# EAGLE design GaN_Schaltnetzteil (EAGLE 9.0.1)
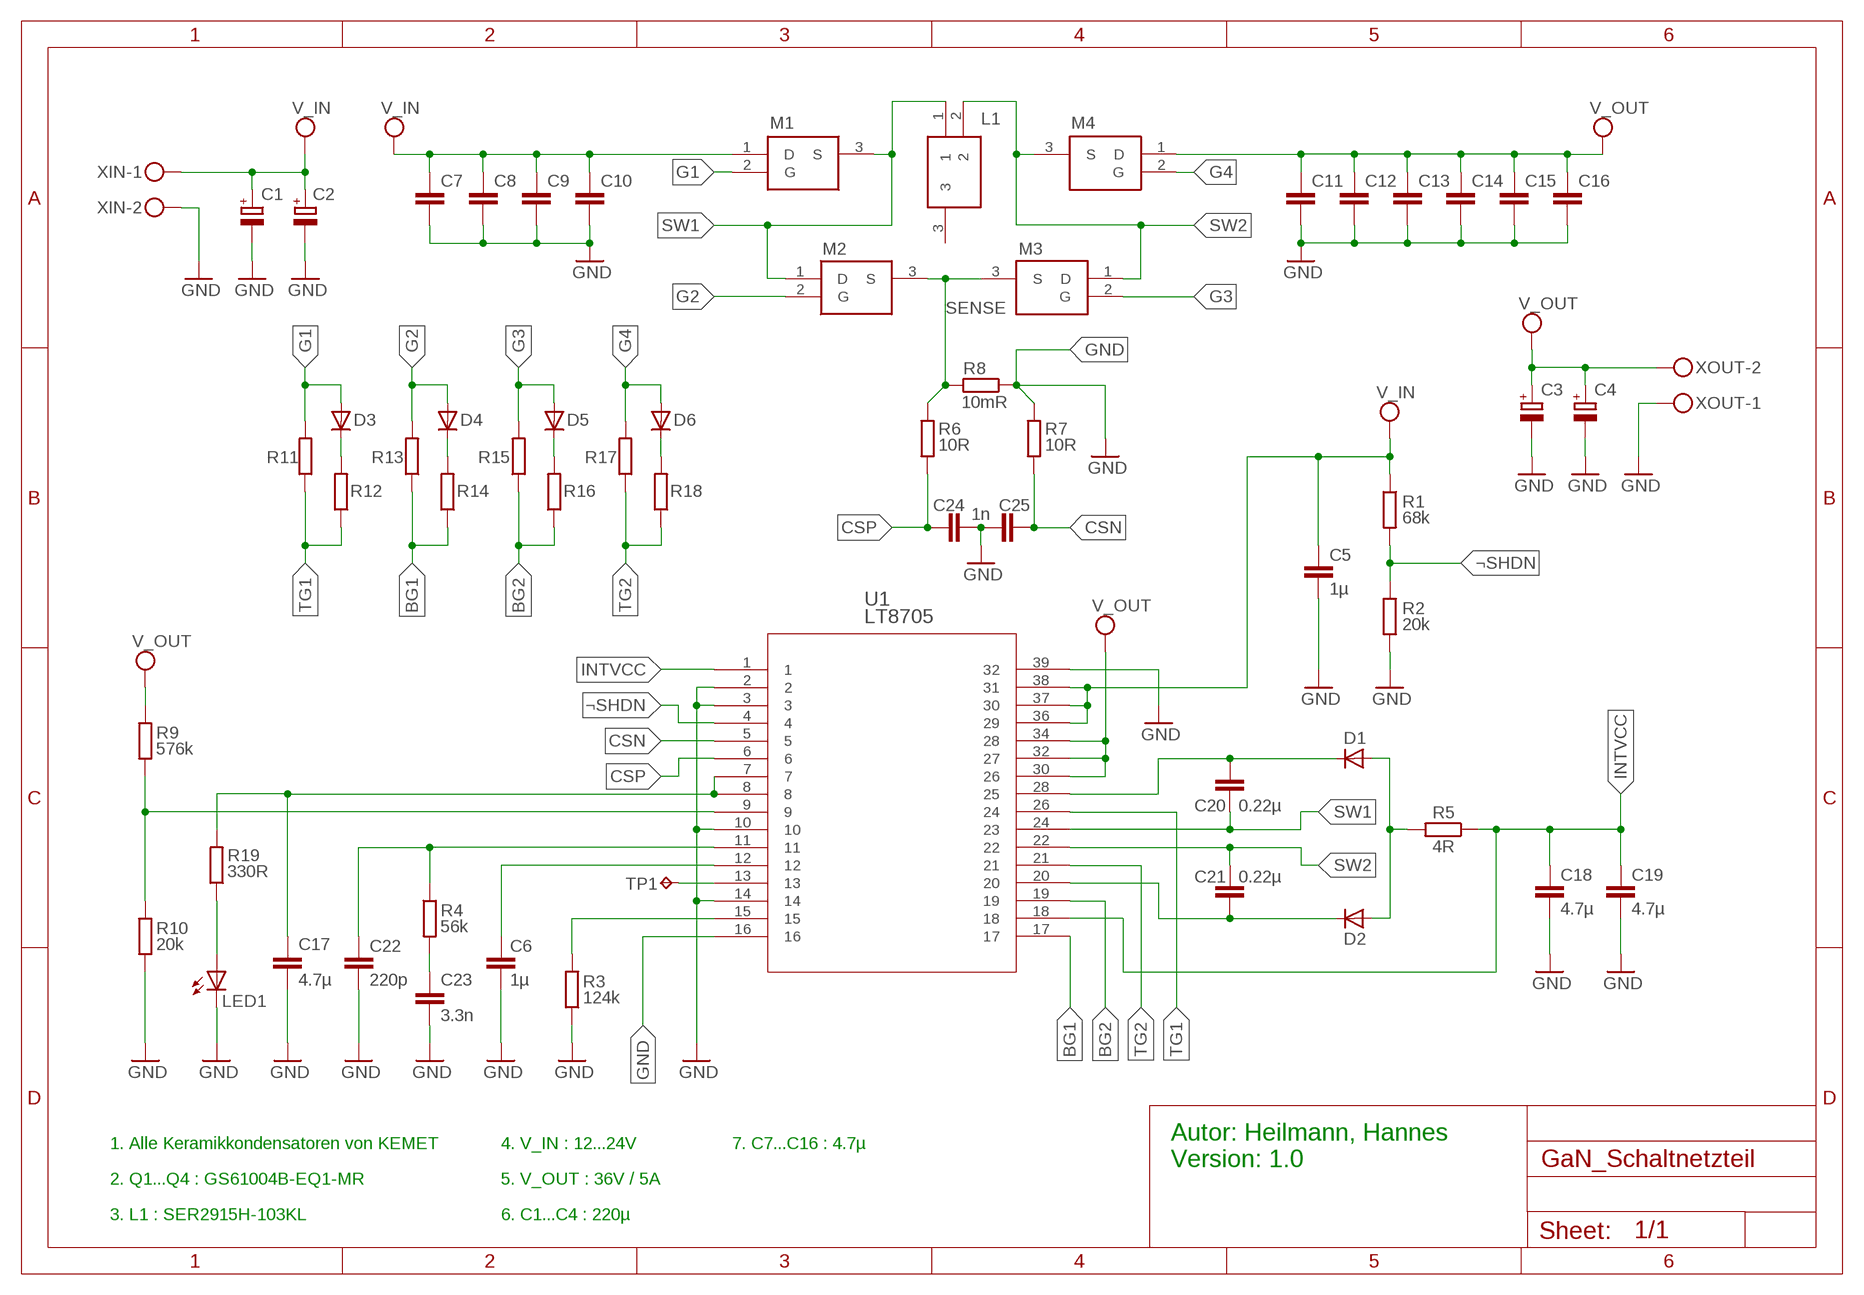
[diagram p0: schematic, sheet 1]

## Parts
C1  220µ  CPOL-EUG  [PANASONIC_G]
C2  220µ  CPOL-EUG  [PANASONIC_G]
C3  220µ  CPOL-EUG  [PANASONIC_G]
C4  220µ  CPOL-EUG  [PANASONIC_G]
C5  1µ  C-EUC1206K  [C1206K]
C6  1µ  C-EUC1206K  [C1206K]
C7  4.7µ  C-EUC1206K  [C1206K]
C8  4.7µ  C-EUC1206K  [C1206K]
C9  4.7µ  C-EUC1206K  [C1206K]
C10  4.7µ  C-EUC1206K  [C1206K]
C11  4.7µ  C-EUC1206K  [C1206K]
C12  4.7µ  C-EUC1206K  [C1206K]
C13  4.7µ  C-EUC1206K  [C1206K]
C14  4.7µ  C-EUC1206K  [C1206K]
C15  4.7µ  C-EUC1206K  [C1206K]
C16  4.7µ  C-EUC1206K  [C1206K]
C17  4.7µ  C-EUC1206K  [C1206K]
C18  4.7µ  C-EUC1206K  [C1206K]
C19  4.7µ  C-EUC1206K  [C1206K]
C20  0.22µ  C-EUC1206K  [C1206K]
C21  0.22µ  C-EUC1206K  [C1206K]
C22  220p  C-EUC1206K  [C1206K]
C23  3.3n  C-EUC1206K  [C1206K]
C24  1n  C-EUC1206K  [C1206K]
C25  1n  C-EUC1206K  [C1206K]
D1  GF1  [SMA-DO214AC]
D2  GF1  [SMA-DO214AC]
D3  GF1  [SMA-DO214AC]
D4  GF1  [SMA-DO214AC]
D5  GF1  [SMA-DO214AC]
D6  GF1  [SMA-DO214AC]
L1  SER2915H-103KL  [SER2900]
LED1  LEDSMT1206  [1206]
M1  GS61004B-E01-MR  [GS61004B-E01-MR]
M2  GS61004B-E01-MR  [GS61004B-E01-MR]
M3  GS61004B-E01-MR  [GS61004B-E01-MR]
M4  GS61004B-E01-MR  [GS61004B-E01-MR]
R1  68k  R-EU_R1206  [R1206]
R2  20k  R-EU_R1206  [R1206]
R3  124k  R-EU_R1206  [R1206]
R4  56k  R-EU_R1206  [R1206]
R5  4R  R-EU_R1206  [R1206]
R6  10R  R-EU_R1206  [R1206]
R7  10R  R-EU_R1206  [R1206]
R8  10mR  R-EU_R1206  [R1206]
R9  576k  R-EU_R1206  [R1206]
R10  20k  R-EU_R1206  [R1206]
R11  R-EU_R1206  [R1206]
R12  R-EU_R1206  [R1206]
R13  R-EU_R1206  [R1206]
R14  R-EU_R1206  [R1206]
R15  R-EU_R1206  [R1206]
R16  R-EU_R1206  [R1206]
R17  R-EU_R1206  [R1206]
R18  R-EU_R1206  [R1206]
R19  330R  R-EU_R1206  [R1206]
TP1  TPTP08R  [TP08R]
U1  LT8705  [TSSOP-38_FE/AB]
XIN  INPUT  W237-102  [W237-102]
XOUT  OUTPUT  W237-102  [W237-102]

## Nets
BG1: R13.1 R14.1 U1.17
BG2: R15.1 R16.1 U1.19
BOOST1: C20.1 D1.K(C) U1.28
BOOST2: C21.1 D2.K(C) U1.20
CSN: C25.2 R7.1 U1.5
CSP: C24.1 R6.1 U1.6
G1: D3.A M1.2(G) R11.2
G2: D4.A M2.2(G) R13.2
G3: D5.A M3.2(G) R15.2
G4: D6.A M4.2(G) R17.2
GND: C1.- C2.- C3.- C4.- C5.2 C6.2 C7.2 C8.2 C9.2 C10.2 C11.2 C12.2 C13.2 C14.2 C15.2 C16.2 C17.2 C18.2 C19.2 C22.2 C23.2 C24.2 C25.1 LED1.C R2.2 R3.1 R7.2 R8.1 R10.2 U1.2 U1.3 U1.10 U1.14 U1.16 U1.39 XIN.2 XOUT.1
INTVCC: C18.1 C19.1 R5.1 U1.1 U1.18
N$1: LED1.A R19.1
N$2: D3.K(C) R12.2
N$6: D4.K(C) R14.2
N$8: TP1.TP U1.13
N$10: C6.1 U1.12
N$11: R3.2 U1.15
N$12: C23.1 R4.2
N$13: D5.K(C) R16.2
N$14: C22.1 R4.1 U1.11
N$17: D6.K(C) R18.2
N$21: R9.2 R10.1 U1.9
N$22: D1.A D2.A R5.2
N$23: C17.1 R19.2 U1.7 U1.8
SENSE: M2.3(S) M3.3(S) R6.2 R8.2
SW1: C20.2 L1.1 M1.3(S) M2.1(D) U1.24
SW2: C21.2 L1.2 M3.1(D) M4.3(S) U1.22
TG1: R11.1 R12.1 U1.26
TG2: R17.1 R18.1 U1.21
VCC: C1.+ C2.+ C5.1 C7.1 C8.1 C9.1 C10.1 M1.1(D) R1.1 U1.36 U1.37 U1.38 XIN.1 ; supply symbol labelled V_IN
VDD: C3.+ C4.+ C11.1 C12.1 C13.1 C14.1 C15.1 C16.1 M4.1(D) R9.1 U1.30 U1.32 U1.34 XOUT.2 ; supply symbol labelled V_OUT
¬SHDN: R1.2 R2.1 U1.4
Unconnected: L1.3

## Notes on the sheet
- 1. Alle Keramikkondensatoren von KEMET | 4. V_IN : 12...24V | 7. C7...C16 : 4.7µ
- Autor: Heilmann, Hannes
  Version: 1.0
- 2. Q1...Q4 : GS61004B-EQ1-MR | 5. V_OUT : 36V / 5A
- 3. L1 : SER2915H-103KL | 6. C1...C4 : 220µ

## Library data of the parts
C1-C4 = rcl:CPOL-EU: POLARIZED CAPACITOR, European symbol; SPICEPREFIX: C
C5-C25 = rcl:C-EU: CAPACITOR, European symbol; SPICEPREFIX: C
D1 = diode:GF1: DIODE; SPICEPREFIX: D
D2-D6 = diode:GF1: DIODE
L1 = SER2915H-103KL:SER2915H-103KL: Fixed Inductors SER2915H Hi Current 10 uH 10 % 30 A Source: Datasheet <https://componentsearchengine.com/Datasheets/2/SER2915H-103KL.pdf>; DESCRIPTION: Fixed Inductors SER2915H Hi Current 10 uH 10 % 30 A; FARNELL_PART_NUMBER: 2288897; HEIGHT: mm; MANUFACTURER_NAME: COILCRAFT; MANUFACTURER_PART_NUMBER: SER2915H-103KL
LED1 = led:LED: LED OSRAM: - CHIPLED LG R971, LG N971, LY N971, LG Q971, LY Q971, LO R971, LY R971 LH N974, LH R974 LS Q976, LO Q976, LY Q976 LO Q996 - Hyper CHIPLED LW Q18S LB Q993, LB Q99A, LB R99A - SideLED LS A670, LO A670, LY A670, LG A670, LP A670 LB A673, LV A673, LT A673, LW A673 LH A674 LY A675 LS A676, LA A676, LO A676, LY A676, LW A676 LS A679, LY A679, LG A679 - Hyper Micro SIDELED® LS Y876, LA Y876, LO Y876, LY Y876 LT Y87S - SmartLED LW L88C, LW L88S LB L89C, LB L89S, LG L890 LS L89K, LO L89K, LY L89K LS L896, LA L896, LO L896, LY L896 - TOPLED LS T670, LO T670, LY T670, LG T670, LP T670 LSG T670, LSP T670, LSY T670, LOP T670, LYG T670 LG T671, LOG T671, LSG T671 LB T673, LV T673, LT T673, LW T673 LH T674 LS T676, LA T676, LO T676, LY T676, LB T676, LH T676, LSB T676, LW T676 LB T67C, LV T67C, LT T67C, LS T67K, LO T67K, LY T67K, LW E67C LS E67B, LA E67B, LO E67B, LY E67B, LB E67C, LV E67C, LT E67C LW T67C LS T679, LY T679, LG T679 LS T770, LO T770, LY T770, LG T770, LP T770 LB T773, LV T773, LT T773, LW T773 LH T774 LS E675, LA E675, LY E675, LS T675 LS T776, LA T776, LO T776, LY T776, LB T776 LHGB T686 LT T68C, LB T68C - Hyper Mini TOPLED® LB M676 - Mini TOPLED Santana® LG M470 LS M47K, LO M47K, LY M47K Source: http://www.osram.convergy.de LUXEON: - LUMILED® LXK2-PW12-R00, LXK2-PW12-S00, LXK2-PW14-U00, LXK2-PW14-V00 LXK2-PM12-R00, LXK2-PM12-S00, LXK2-PM14-U00 LXK2-PE12-Q00, LXK2-PE12-R00, LXK2-PE12-S00, LXK2-PE14-T00, LXK2-PE14-U00 LXK2-PB12-K00, LXK2-PB12-L00, LXK2-PB12-M00, LXK2-PB14-N00, LXK2-PB14-P00, LXK2-PB14-Q00 LXK2-PR12-L00, LXK2-PR12-M00, LXK2-PR14-Q00, LXK2-PR14-R00 LXK2-PD12-Q00, LXK2-PD12-R00, LXK2-PD12-S00 LXK2-PH12-R00, LXK2-PH12-S00 LXK2-PL12-P00, LXK2-PL12-Q00, LXK2-PL12-R00 Source: www.luxeon.com KINGBRIGHT: KA-3528ASYC Source: www.kingbright.com
M1-M4 = GS61004B-E01-MR:GS61004B-E01-MR: MOSFET 100V 45A E-Mode GaN Source: Datasheet <https://componentsearchengine.com/Datasheets/1/GS61004B-E01-MR.pdf>; DESCRIPTION: MOSFET 100V 45A E-Mode GaN; HEIGHT: mm; MANUFACTURER_NAME: GaN Systems; MANUFACTURER_PART_NUMBER: GS61004B-E01-MR; MOUSER_PART_NUMBER: 499-GS61004B-E01-MR
R1-R19 = resistor:R-EU_: RESISTOR, European symbol
TP1 = testpad:TP: Test pad
U1 = LT8705:LT8705
XIN XOUT = con-wago-500:W237-102: WAGO SCREW CLAMP; MPN: 237-102; OC_FARNELL: unknown; OC_NEWARK: 70K9898

## Board
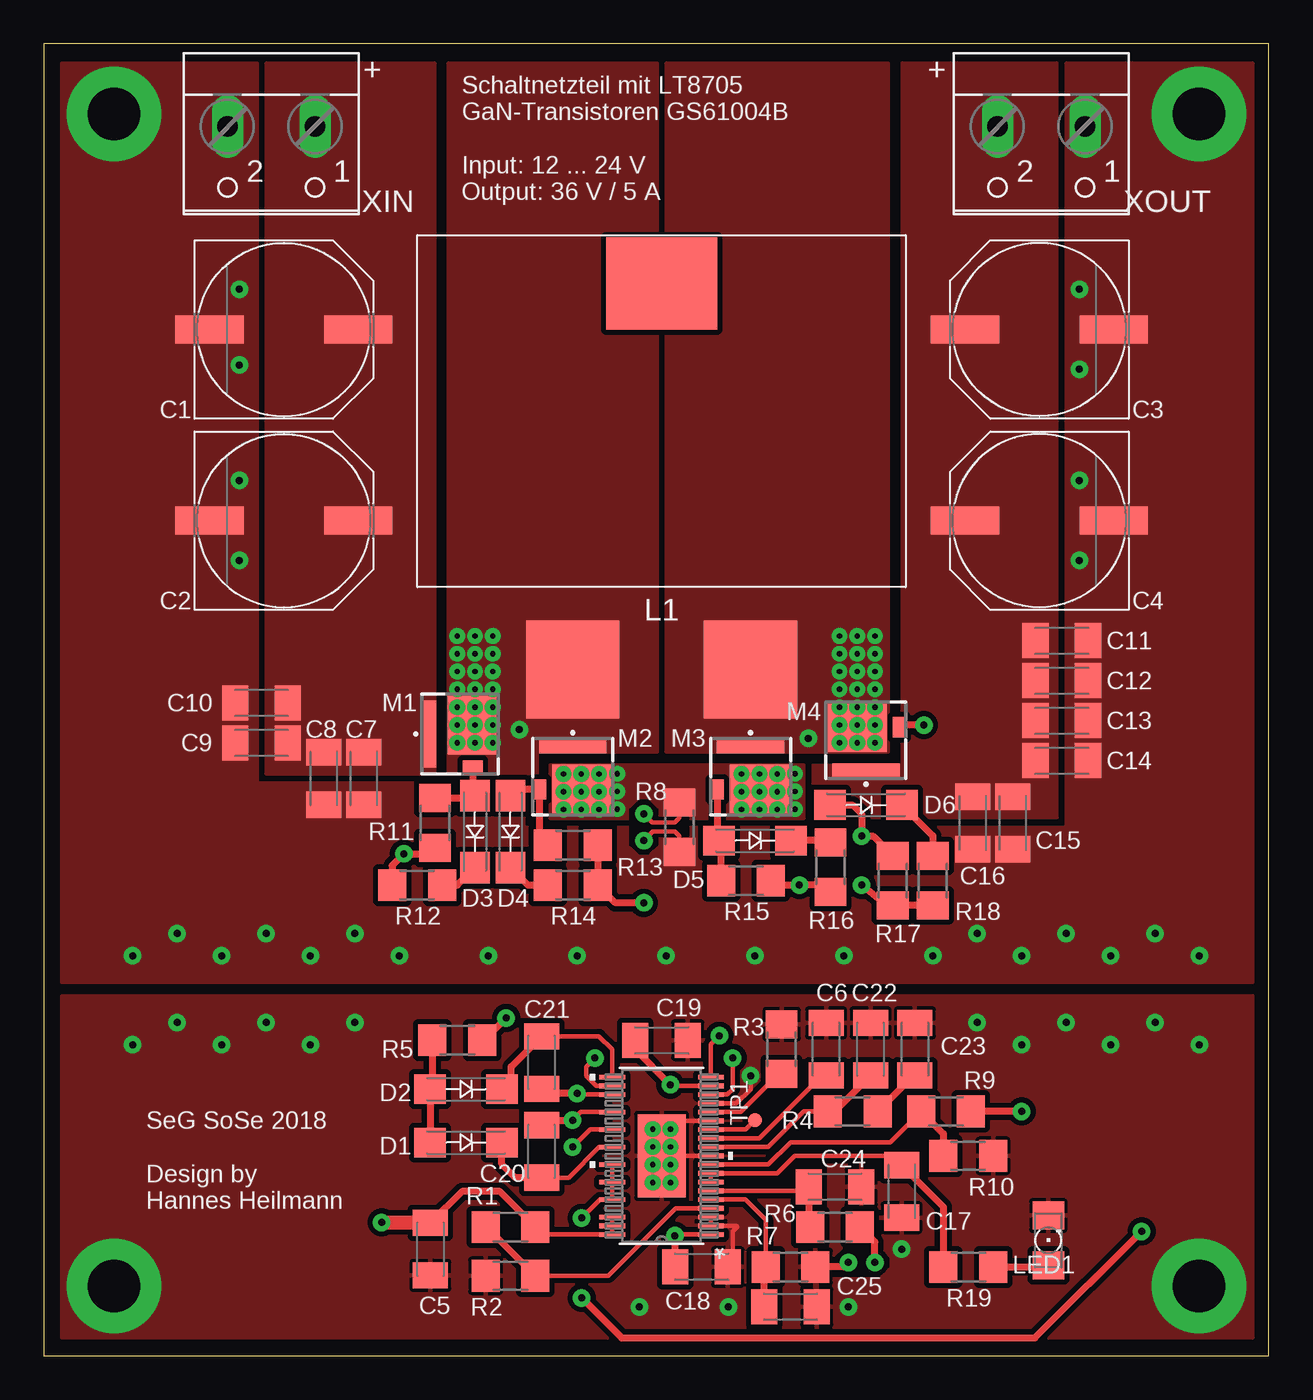
[diagram p1: board, top side]
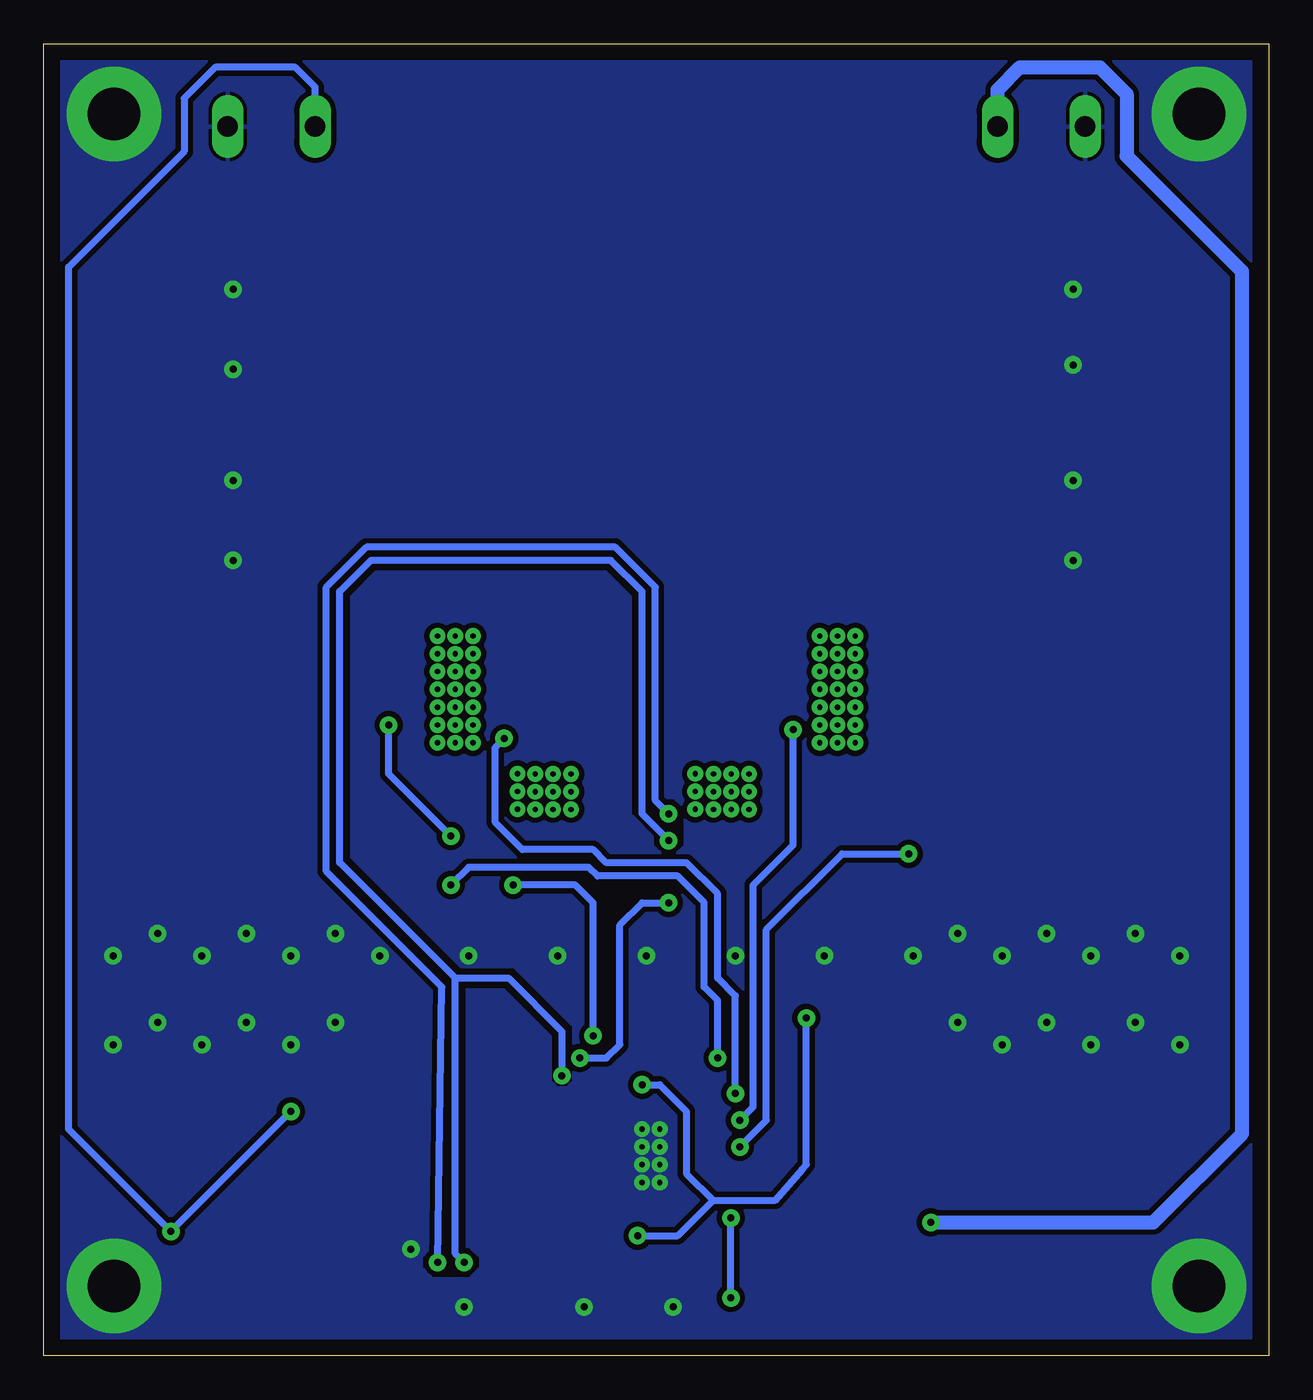
[diagram p2: board, bottom side, seen from below]

Size 70 x 75 mm. Coordinates in mm from the lower left corner, seen from the top.
Outline: 0,0 70,0 70,75 0,75 0,0
Copper layers (1*16): Top 0.035mm / dielectric 1.5mm / Bottom 0.035mm
Design rules "Labor": minimum track width 0.3mm, minimum drill 0.4mm, track to track 0.3mm, track to pad 0.3mm, pad to pad 0.3mm, via to via 0.3mm, smd to smd 0.15mm, copper to edge 0.5mm, drill to drill 0.2mm, minimum pad ring 0.3mm, minimum via ring 0.3mm, stop-mask expansion 0.075mm, vias tented up to drill 0mil, thermal gap 0.2mm
tRestrict: area 33.5,28.7 to 35.1,31.8; area 45.2,4.6 to 48.3,6.1; area 34.8,29.7 to 36.8,30.7
bRestrict: area 45.2,4.6 to 48.3,6.1; area 35.1,5.3 to 53.3,45.7; area 33.5,28.7 to 35.1,31.8; area 43.2,21.1 to 46.2,22.1; area 39.9,15.5 to 43.9,22.1

### Footprints (pad centres in the part's own frame; a part is rotated, then mirrored left to right if it is on the bottom)
PANASONIC_G = smd 3.9 x 1.6: + 4.25,0; - -4.25,0
C1206K = smd 1.5 x 2: 1 -1.5,0; 2 1.5,0
SMA-DO214AC = smd 1.8 x 1.7: A -2.05,0; K 2.05,0
SER2900 = smd 5.33 x 5.59: 1 -5.075,-14.355; 2 5.075,-14.355 | smd 6.35 x 5.28: 3 0,7.72
1206 = smd 1.6 x 1.803: A -1.422,0; C 1.422,0
GS61004B-E01-MR = smd 3.85 x 0.85: 1 0,-0.425 | smd 0.75 x 1.15: 2 -1.9,-2.925 | smd 3.45 x 2.85: 3 0.55,-2.925
R1206 = smd 1.6 x 1.803: 1 -1.422,0; 2 1.422,0
TP08R = smd 0.8 x 0.8: TP 0,0
TSSOP-38_FE/AB = smd 1.473 x 0.279: 1 -2.819,4.5; 2 -2.819,4; 3 -2.819,3.5; 4 -2.819,3; 5 -2.819,2.5; 6 -2.819,2; 7 -2.819,1.5; 8 -2.819,1; 9 -2.819,0.5; 10 -2.819,0; 11 -2.819,-0.5; 12 -2.819,-1; 13 -2.819,-1.5; 14 -2.819,-2; 15 -2.819,-2.5; 16 -2.819,-3; 17 -2.819,-3.5; 18 -2.819,-4; 19 -2.819,-4.5; 20 2.819,-4.5; 21 2.819,-4; 22 2.819,-3.5; 24 2.819,-2.5; 26 2.819,-1.5; 28 2.819,-0.5; 30 2.819,0.5; 32 2.819,1.5; 34 2.819,2.5; 36 2.819,3.5; 37 2.819,4; 38 2.819,4.5 | smd 2.743 x 4.75: 39 0,0
W237-102 = drill 1.194 long: 1 -2.5,-1.27; 2 2.5,-1.27

### Placement (x,y rotation side)
C1  13.72,58.66 0 top
C2  13.72,47.74 0 top
C3  56.9,58.66 180 top
C4  56.9,47.74 180 top
C5  22.1,6.1 270 top
C6  44.7,17.53 90 top
C7  18.29,33 270 top
C8  16,33 270 top
C9  12.45,35.04 180 top
C10  12.45,37.32 180 top
C11  58.17,40.88 0 top
C12  58.17,38.59 0 top
C13  58.17,36.31 0 top
C14  58.17,34.02 0 top
C15  55.37,30.46 270 top
C16  53.09,30.46 270 top
C17  49.02,9.4 270 top
C18  37.59,5.08 0 top
C19  35.31,18.03 0 top
C20  28.45,11.68 90 top
C21  28.45,16.76 270 top
C22  47.24,17.53 90 top
C23  49.78,17.53 90 top
C24  45.21,9.65 0 top
C25  42.67,2.79 180 top
D1  24.13,12.19 0 top
D2  24.13,15.24 0 top
D3  24.64,29.96 270 top
D4  26.67,29.96 270 top
D5  40.64,29.45 0 top
D6  46.99,31.48 0 top
L1  35.31,53.58 0 top
LED1  57.4,6.6 90 top
M1  21.59,35.54 90 top
M2  30.23,35.29 0 top
M3  40.39,35.29 0 top
M4  46.99,33 180 top
R1  26.67,7.37 180 top
R2  26.67,4.57 180 top
R3  42.16,17.53 270 top
R4  46.23,13.97 0 top
R5  23.62,18.03 180 top
R6  45.21,7.37 0 top
R7  42.67,5.08 0 top
R8  36.32,30.21 90 top
R9  51.56,13.97 180 top
R10  52.83,11.43 0 top
R11  22.35,30.46 90 top
R12  21.34,26.91 0 top
R13  30.23,29.19 180 top
R14  30.23,26.91 180 top
R15  40.13,27.16 180 top
R16  44.96,27.92 90 top
R17  48.51,27.16 90 top
R18  50.8,27.16 90 top
R19  52.83,5.08 180 top
TP1  40.64,13.46 90 top
U1  35.31,11.43 180 top
XIN  13,69 180 top
XOUT  57,69 180 top

### Tracks (layer width: path | path; a pad name or v marks a point on that pad's centre or on a via)
BG1  (via drill 0.4)
  Top 0.254: U1.17 39.06,14.93 39.37,15.24 v39.37,17.02
  Top 0.406: v34.29,25.89 32.66,25.89 R14.1 R13.1
  Bottom 0.406: v34.29,25.89 35.81,25.89 37.08,24.62 37.08,17.78 37.85,17.02 v39.37,17.02
BG2  (via drill 0.4)
  Top 0.254: U1.19 38.12,17.8 v38.61,18.29
  Top 0.406: R15.1 41.81,26.91 v43.18,26.91 44.55,26.91 R16.1
  Bottom 0.406: v43.18,26.91 39.62,26.91 38.61,25.89 v38.61,18.29
BOOST1
  Top 0.254: U1.28 31.74,11.93 30,10.18 C20.1
  Top 0.406: C20.1 26.95,10.18 26.18,10.95 D1.K
BOOST2
  Top 0.254: C21.1 31.73,18.26 32.49,17.5 U1.20
  Top 0.406: D2.K 26.43,15.24 26.71,15.52 26.71,16.53 C21.1
CSN
  Top 0.254: R7.1 41.25,7.77 40.09,8.93 U1.5
  Top 0.406: C25.2 41.17,5 R7.1
CSP
  Top 0.254: U1.6 43.49,9.43 C24.1
  Top 0.406: C24.1 43.71,7.44 R6.1
G1
  Top 0.406: M1.2 24.52,32.13 | 24.52,32.13 D3.A | R11.2 24.27,31.89 24.52,32.13
G2
  Top 0.406: D4.A 27.03,32.37 M2.2 28.33,29.67 R13.2
G3
  Top 0.406: 38.34,32.5 M3.2 38.49,29.55 D5.A 38.71,29.33 R15.2
G4  (via drill 0.4)
  Top 0.406: D6.A 46.23,31.48 46.74,30.97 v46.74,29.7 47.4,29.7 R17.2 | v50.29,36.05 49.01,36.05 M4.2
  Bottom 0.406: v46.74,29.7 50.29,33.26 v50.29,36.05
GND  (via drill 0.3, 0.4, 3)
  Top 0.254: C18.2 39.37,5.36 39.37,7.11 39.62,7.37 39.56,7.43 U1.2 U1.3 | U1.10 36.32,11.43 v35.81,11.94 | U1.14 36.29,13.43 v35.81,12.95 | U1.16 39.58,14.43 40.39,15.24 v40.39,16 | v34.29,29.45 34.81,29.97 36.07,29.97 36.32,29.72 36.32,29.21
  Top 0.406: v45.97,5.33 45.72,5.08 R7.2
  Bottom 0.406: v34.29,29.45 35.81,30.97 35.81,43.69 37.59,45.47 51.31,45.47 53.09,43.69 53.09,28.19 46.48,21.59 | 46.48,21.59 43.43,21.59 40.39,18.54 v40.39,16 | v45.97,5.33 46.48,5.84 46.48,21.59
  other vias: 34.8,12.95 34.8,11.94 34.8,9.91 34.8,10.92 35.81,10.92 35.81,9.91 53.34,19.05 55.88,17.78 58.42,19.05 34.04,2.79 39.12,2.79 60.96,17.78 63.5,19.05 50.8,22.86 53.34,24.13 55.88,22.86 58.42,24.13 60.96,22.86 63.5,24.13 66.04,22.86 7.62,19.05 10.16,17.78 12.7,19.05 15.24,17.78 17.78,19.05 5.08,22.86 7.62,24.13 12.7,24.13 10.16,22.86 15.24,22.86 17.78,24.13 20.32,22.86 45.97,2.79 49.02,6.1 66.04,17.78 5.08,17.78 4,4 66,4 4,71 66,71 45.72,22.86 40.64,22.86 30.48,22.86 35.56,22.86 25.4,22.86 11.18,60.96 11.18,56.64 11.18,50.04 11.18,45.47 59.18,60.96 59.18,56.39 59.18,50.04 59.18,45.47
  pour Bottom: 1,74 69,74 69,1 1,1
  pour Top (no thermals): 1.02,73.9 12.19,73.9 12.19,32.75 27.43,32.75 27.43,30.21 58.42,30.21 58.42,73.9 69.09,73.9 69.09,21.34 1.02,21.34
  pour Top: 1.02,20.57 69.09,20.57 69.09,1.02 1.02,1.02
INTVCC  (via drill 0.4)
  Top 0.254: U1.18 35.88,15.43 v35.81,15.49 | U1.1 36.14,6.93 v36.07,6.86
  Top 0.406: v35.81,15.49 33.81,17.5 C19.1 | v36.07,6.86 36.07,5.08 C18.1 | R5.1 25.15,18.03 v26.42,19.3
  Bottom 0.406: v35.81,15.49 34.8,15.49 33.27,13.97 33.27,10.41 31.75,8.89 | 31.75,8.89 28.19,8.89 26.67,10.67 26.42,10.92 v26.42,19.3 | v36.07,6.86 33.78,6.86 31.75,8.89
N$1
  Top 0.406: R19.1 57.3,5.08 LED1.A
N$2
  Top 0.406: D3.K 23.64,26.91 R12.2
N$6
  Top 0.406: D4.K 27.67,26.91 R14.2
N$8
  Top 0.254: U1.13 40.11,12.93 TP1.TP
N$10
  Top 0.254: U1.12 40.88,12.43 44.47,16.03 C6.1
N$11
  Top 0.254: R3.2 42.01,16.1 39.84,13.93 U1.15
N$12
  Top 0.406: 47.75,14.33 R4.2 49.71,16.03 C23.1
N$13
  Top 0.406: R16.2 44.86,29.45 D5.K
N$14
  Top 0.254: U1.11 41.39,11.93 43.43,13.97 R4.1
  Top 0.406: 45.06,14.22 R4.1 45.19,13.97 C22.1
N$17
  Top 0.406: D6.K 50.8,29.72 R18.2
N$21
  Top 0.254: U1.9 41.41,10.93 42.67,12.19 48.36,12.19 R9.2
  Top 0.406: R9.2 51.41,12.7 R10.1
N$22
  Top 0.406: R5.2 22.2,15.37 D2.A D1.A
N$23
  Top 0.254: U1.7 U1.8 41.93,10.43 42.93,11.43 48.49,11.43 C17.1
  Top 0.406: C17.1 51.41,8.51 R19.2
SENSE  (via drill 0.3, 0.4)
  Top 0.254: v34.29,30.97 34.78,30.48 36.07,30.48 36.32,30.73 36.32,31.5
  Top 0.406: v47.5,5.33 47.5,6.5 R6.2
  Bottom 0.406: v34.29,30.97 35.05,31.73 35.05,43.94 37.34,46.23 51.56,46.23 53.85,43.94 53.85,27.69 47.24,21.08 v47.5,5.33
  other vias: 29.7,33.26 30.72,33.26 31.73,33.26 29.7,32.24 30.72,32.24 31.73,32.24 30.72,31.23 29.7,31.23 31.73,31.23 39.88,33.26 40.89,33.26 41.91,33.26 39.88,32.24 40.89,32.24 41.91,32.24 39.88,31.23 40.89,31.23 41.91,31.23 42.93,31.24 42.93,32.26 42.93,33.27 32.77,33.27 32.77,32.26 32.77,31.24
  pour Top (no thermals): 28.96,33.77 43.43,33.77 43.43,30.72 28.96,30.72
SW1  (via drill 0.3, 0.4)
  Top 0.254: U1.24 30.69,13.93 v30.23,13.46
  Top 0.406: 28.73,13.18 C20.2 28.45,13.46 v30.23,13.46
  Bottom 0.406: v27.18,35.8 27.18,29.19 29.46,26.91 29.46,14.22 v30.23,13.46
  other vias: 23.62,37.07 24.64,37.07 25.65,37.07 23.62,36.05 24.64,36.05 25.65,36.05 23.62,35.04 24.64,35.04 25.65,35.04 23.62,41.15 24.64,40.13 25.65,39.12 25.65,41.15 23.62,39.12 24.64,41.15 23.62,40.13 24.64,39.12 25.65,40.13 23.62,38.1 24.64,38.1 25.65,38.1
  pour Top (no thermals): 23.11,33.26 28.19,33.26 28.19,34.53 35.05,34.53 35.05,73.9 23.11,73.9
SW2  (via drill 0.3, 0.4)
  Top 0.254: 30.54,14.93 U1.22
  Top 0.406: C21.2 28.45,14.99 v30.48,14.99 30.54,14.93
  Bottom 0.406: v30.48,14.99 30.48,20.57 31.5,21.59 31.5,26.42 33.26,28.18 37.85,28.18 38.61,28.94 42.66,28.94 44.2,30.48 44.2,34.8 44.18,34.8 v43.69,35.29
  other vias: 45.47,37.07 46.48,37.07 47.5,37.07 45.47,36.05 46.48,36.05 47.5,36.05 45.47,35.04 46.48,35.04 47.5,35.04 46.48,40.13 47.5,41.15 45.47,39.12 47.5,39.12 45.47,41.15 46.48,41.15 46.48,39.12 45.47,40.13 47.5,40.13 45.47,38.1 46.48,38.1 47.5,38.1
  pour Top (no thermals): 35.56,73.9 48.26,73.9 48.26,34.53 35.56,34.53
TG1  (via drill 0.4)
  Top 0.254: U1.26 31.22,12.93 v30.23,11.94
  Top 0.406: R11.1 22,28.69 v20.57,28.69 19.91,28.03 R12.1
  Bottom 0.406: v20.57,28.69 24.38,28.69 28.7,24.37 28.7,13.46 v30.23,11.94
TG2  (via drill 0.4)
  Top 0.254: U1.21 31.56,15.43 30.99,16 30.99,16.51 v31.5,17.02
  Top 0.406: v46.74,26.91 48.16,25.74 R17.1 R18.1
  Bottom 0.406: v46.74,26.91 45.72,27.92 38.86,27.92 38.35,27.42 33.77,27.42 32.26,25.91 32.26,21.08 31.5,20.32 v31.5,17.02
VCC  (via drill 0.4)
  Top 0.254: U1.36 U1.37 U1.38 28.53,6.93 R1.1
  Top 0.406: R1.1 26.06,9.4 23.9,9.4 C5.1 22.07,7.62
  Top 0.813: v19.3,7.62 22.07,7.62
  Bottom 0.813: XIN.1 15.5,72.37 14.22,73.64 9.65,73.64 8.13,72.12 8.13,68.58 1.52,61.98 1.52,12.7 6.6,7.62 v19.3,7.62
  pour Top (no thermals): 12.7,73.9 12.7,33.26 22.35,33.26 22.35,73.9
VDD  (via drill 0.4)
  Top 0.254: U1.30 U1.32 U1.34 31.79,8.93 v30.73,7.87
  Top 0.406: v30.73,3.3 33.02,1.02 56.64,1.02 v62.74,7.11 | v55.88,13.97 R9.1
  Bottom 0.406: XOUT.2 54.5,72.52 55.63,73.64 60.21,73.64 61.98,71.88 61.98,68.83 68.58,62.23 68.58,12.95 v62.74,7.11 v55.88,13.97 | v30.73,3.3 v30.73,7.87
  pour Top (no thermals): 43.94,33.78 43.94,30.73 57.91,30.73 57.91,73.91 49.02,73.91 49.02,33.78
¬SHDN
  Top 0.254: U1.4 36.12,8.43 32.26,4.57 R2.1
  Top 0.406: R2.1 25.3,7.37 R1.2

### Text on the board
tNames: + | + | Schaltnetzteil mit LT8705 / GaN-Transistoren GS61004B / / Input: 12 ... 24 V / Output: 36 V / 5 A | SeG SoSe 2018 / / Design by / Hannes Heilmann